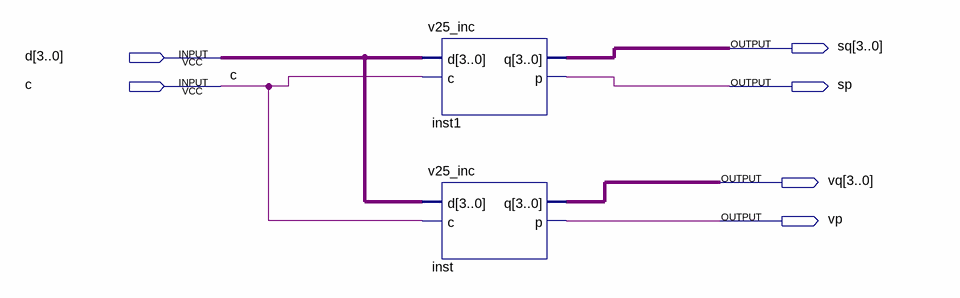
[diagram p0: schematic sheet]
// Quartus schematic sv25_inc.bdf as structural Verilog: 2 symbols, 6 pins
module sv25_inc (
  input  [3:0] d,
  input  c,
  output [3:0] sq,
  output sp,
  output [3:0] vq,
  output vp
);

  v25_inc inst1 (.d(d), .c(c), .q(sq), .p(sp));
  v25_inc inst (.d(d), .c(c), .q(vq), .p(vp));
endmodule
